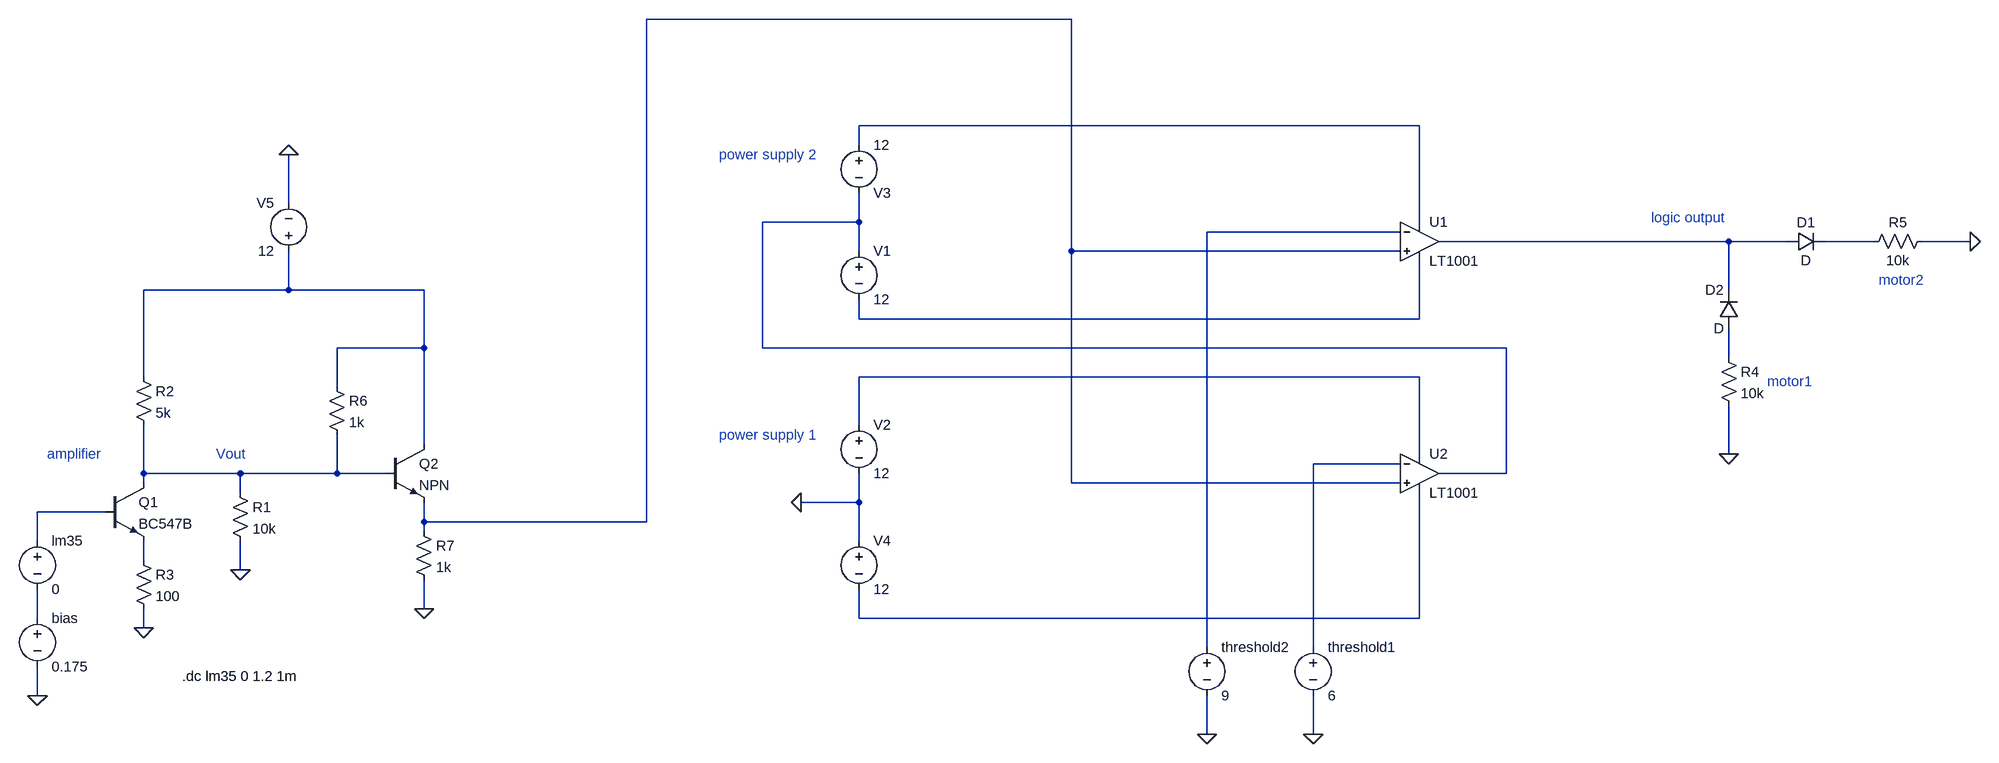
[diagram p0: schematic IE_final_design-draft1.asc]
IE_final_design-draft1.asc, the LTspice schematic file:
Version 4
SHEET 1 2676 680
WIRE 1168 -624 464 -624
WIRE 1744 -448 816 -448
WIRE 816 -416 816 -448
WIRE -128 -320 -128 -400
WIRE 816 -288 816 -336
WIRE 816 -288 656 -288
WIRE 1744 -288 1744 -448
WIRE 1712 -272 1392 -272
WIRE 2256 -256 1776 -256
WIRE 2352 -256 2256 -256
WIRE 2496 -256 2416 -256
WIRE 2656 -256 2576 -256
WIRE 816 -240 816 -288
WIRE 1168 -240 1168 -624
WIRE 1712 -240 1168 -240
WIRE -128 -176 -128 -240
WIRE -128 -176 -368 -176
WIRE 96 -176 -128 -176
WIRE 2256 -176 2256 -256
WIRE 816 -128 816 -160
WIRE 1744 -128 1744 -224
WIRE 1744 -128 816 -128
WIRE 96 -80 96 -176
WIRE 96 -80 -48 -80
WIRE 656 -80 656 -288
WIRE 1888 -80 656 -80
WIRE 2256 -64 2256 -112
WIRE -368 -32 -368 -176
WIRE 1744 -32 816 -32
WIRE -48 -16 -48 -80
WIRE 816 48 816 -32
WIRE 96 80 96 -80
WIRE 1744 96 1744 -32
WIRE 2256 96 2256 16
WIRE 1712 112 1568 112
WIRE -368 128 -368 48
WIRE -208 128 -368 128
WIRE -48 128 -48 64
WIRE -48 128 -208 128
WIRE 32 128 -48 128
WIRE 1888 128 1888 -80
WIRE 1888 128 1776 128
WIRE -368 144 -368 128
WIRE 1168 144 1168 -240
WIRE 1712 144 1168 144
WIRE -208 160 -208 128
WIRE 816 176 816 128
WIRE 816 176 720 176
WIRE -432 192 -544 192
WIRE 96 208 96 176
WIRE 464 208 464 -624
WIRE 464 208 96 208
WIRE 96 224 96 208
WIRE -544 240 -544 192
WIRE 816 240 816 176
WIRE -368 272 -368 240
WIRE -208 288 -208 240
WIRE 96 352 96 304
WIRE -544 368 -544 320
WIRE 816 368 816 320
WIRE 1744 368 1744 160
WIRE 1744 368 816 368
WIRE -368 384 -368 352
WIRE 1392 416 1392 -272
WIRE 1568 416 1568 112
WIRE -544 496 -544 448
WIRE 1392 560 1392 496
WIRE 1568 560 1568 496
FLAG -208 288 0
FLAG -544 496 0
FLAG -368 384 0
FLAG 720 176 0
FLAG 1392 560 0
FLAG 1568 560 0
FLAG 2656 -256 0
FLAG 2256 96 0
FLAG -128 -400 0
FLAG 96 352 0
SYMBOL voltage -544 224 R0
SYMATTR InstName lm35
SYMATTR Value 0
SYMBOL voltage -544 352 R0
WINDOW 123 0 0 Left 0
WINDOW 39 0 0 Left 0
SYMATTR InstName bias
SYMATTR Value 0.175
SYMBOL voltage 816 -432 R0
WINDOW 0 24 96 Left 2
WINDOW 3 24 16 Left 2
WINDOW 123 0 0 Left 0
WINDOW 39 0 0 Left 0
SYMATTR InstName V3
SYMATTR Value 12
SYMBOL npn -432 144 R0
SYMATTR InstName Q1
SYMATTR Value BC547B
SYMBOL res -384 -48 R0
SYMATTR InstName R2
SYMATTR Value 5k
SYMBOL res -384 256 R0
SYMATTR InstName R3
SYMATTR Value 100
SYMBOL res -224 144 R0
SYMATTR InstName R1
SYMATTR Value 10k
SYMBOL OpAmps\\LT1001 1744 -320 R0
SYMATTR InstName U1
SYMBOL OpAmps\\LT1001 1744 64 R0
SYMATTR InstName U2
SYMBOL voltage 816 -256 R0
WINDOW 123 0 0 Left 0
WINDOW 39 0 0 Left 0
SYMATTR InstName V1
SYMATTR Value 12
SYMBOL voltage 1392 400 R0
WINDOW 123 0 0 Left 0
WINDOW 39 0 0 Left 0
SYMATTR InstName threshold2
SYMATTR Value 9
SYMBOL voltage 1568 400 R0
WINDOW 123 0 0 Left 0
WINDOW 39 0 0 Left 0
SYMATTR InstName threshold1
SYMATTR Value 6
SYMBOL diode 2352 -240 R270
WINDOW 0 32 32 VTop 2
WINDOW 3 0 32 VBottom 2
SYMATTR InstName D1
SYMBOL diode 2272 -112 R180
WINDOW 0 24 64 Left 2
WINDOW 3 24 0 Left 2
SYMATTR InstName D2
SYMBOL res 2240 -80 R0
SYMATTR InstName R4
SYMATTR Value 10k
SYMBOL res 2592 -272 R90
WINDOW 0 0 56 VBottom 2
WINDOW 3 32 56 VTop 2
SYMATTR InstName R5
SYMATTR Value 10k
SYMBOL voltage 816 32 R0
WINDOW 123 0 0 Left 0
WINDOW 39 0 0 Left 0
SYMATTR InstName V2
SYMATTR Value 12
SYMBOL voltage 816 224 R0
WINDOW 123 0 0 Left 0
WINDOW 39 0 0 Left 0
SYMATTR InstName V4
SYMATTR Value 12
SYMBOL voltage -128 -224 R180
WINDOW 0 24 96 Left 2
WINDOW 3 24 16 Left 2
WINDOW 123 0 0 Left 0
WINDOW 39 0 0 Left 0
SYMATTR InstName V5
SYMATTR Value 12
SYMBOL npn 32 80 R0
SYMATTR InstName Q2
SYMBOL res -64 -32 R0
SYMATTR InstName R6
SYMATTR Value 1k
SYMBOL res 80 208 R0
SYMATTR InstName R7
SYMATTR Value 1k
TEXT -248 96 Left 2 ;Vout
TEXT -304 464 Left 2 !.dc lm35 0 1.2 1m
TEXT -528 96 Left 2 ;amplifier
TEXT 584 -400 Left 2 ;power supply 2
TEXT 2128 -296 Left 2 ;logic output
TEXT 2320 -24 Left 2 ;motor1
TEXT 2504 -192 Left 2 ;motor2
TEXT 584 64 Left 2 ;power supply 1

The netlist it stands for:
* IE_final_design-draft1.asc
V§lm35 N013 N015 0
V§bias N015 0 0.175
V3 N002 N003 12
Q1 N012 N013 N014 0 BC547B
R2 N007 N012 5k
R3 N014 0 100
R1 N012 0 10k
XU1 N001 N004 N002 N008 N005 LT1001  ; pins In+ In- V+ V- OUT
XU2 N001 N011 N010 N016 N003 LT1001  ; pins In+ In- V+ V- OUT
V1 N003 N008 12
V§threshold2 N004 0 9
V§threshold1 N011 0 6
D1 N005 N006 D
D2 N009 N005 D
R4 N009 0 10k
R5 0 N006 10k
V2 N010 0 12
V4 0 N016 12
V5 N007 0 12
Q2 N007 N012 N001 0 NPN
R6 N007 N012 1k
R7 N001 0 1k
.model D D
.lib standard.dio
.model NPN NPN
.model PNP PNP
.lib standard.bjt
* Vout
.dc lm35 0 1.2 1m
* amplifier
* power supply 2
* logic output
* motor1
* motor2
* power supply 1
.lib LTC.lib
.backanno
.end